# EAGLE design shield_mega_seed4_mpu_lobo8 (EAGLE 9.2.2)
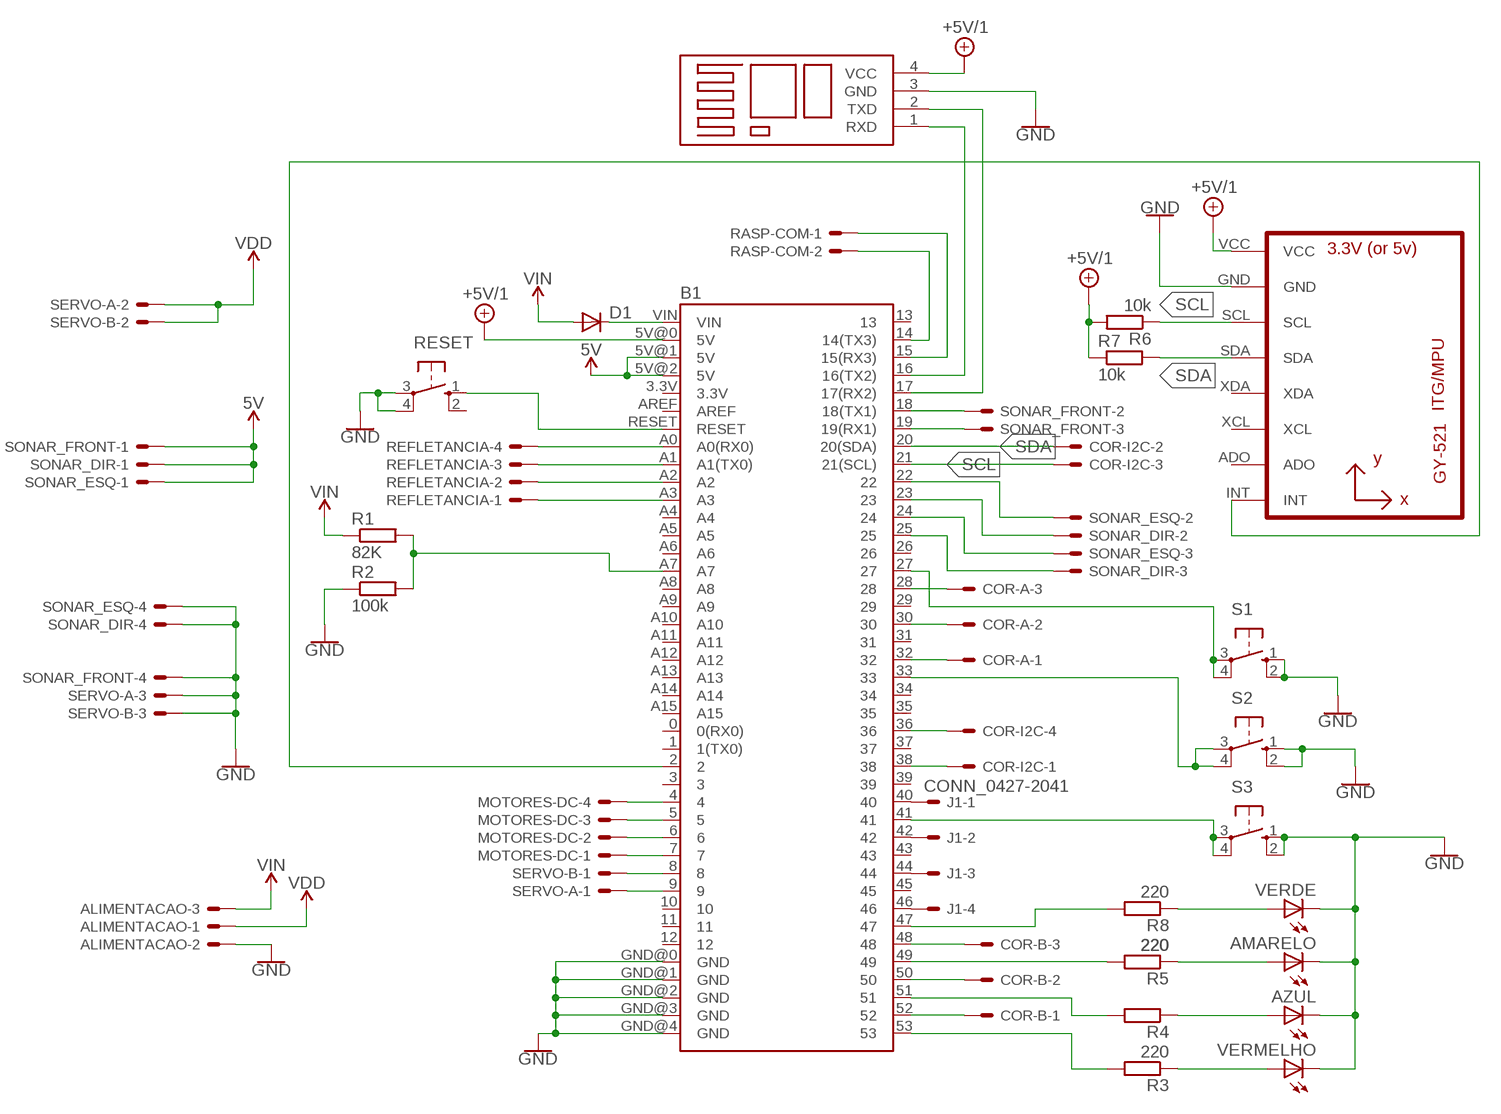
[diagram p0: schematic, sheet 1]

## Parts
ALIMENTACAO  22-23-2031  [22-23-2031]
AMARELO  LED5MM  [LED5MM]
AZUL  LED5MM  [LED5MM]
B1  ARDUINO_MEGA_R3FULL  [ARDUINO_MEGA]
B2  BLUETOOTH  [BLUETOOTH]
COR-A  22-23-2031  [22-23-2031]
COR-B  22-23-2031  [22-23-2031]
COR-I2C  22-23-2041  [22-23-2041]
D1  1N4004  [DO41-10]
J1  CONN_0427-2041  [6410-04]
MOTORES-DC  22-23-2041  [22-23-2041]
R1  82K  R-EU_0204/7  [0204/7]
R2  100k  R-EU_0204/7  [0204/7]
R3  220  R-EU_0207/7  [0207/7]
R4  220  R-EU_0207/7  [0207/7]
R5  220  R-EU_0207/7  [0207/7]
R6  10k  R-EU_0204/7  [0204/7]
R7  10k  R-EU_0204/7  [0204/7]
R8  220  R-EU_0207/7  [0207/7]
RASP-COM  22-23-2021  [22-23-2021]
REFLETANCIA  22-23-2041  [22-23-2041]
RESET  10-XX  [B3F-10XX]
S1  10-XX  [B3F-10XX]
S2  10-XX  [B3F-10XX]
S3  10-XX  [B3F-10XX]
SERVO-A  22-23-2031  [22-23-2031]
SERVO-B  22-23-2031  [22-23-2031]
SONAR_DIR  22-23-2041  [22-23-2041]
SONAR_ESQ  22-23-2041  [22-23-2041]
SONAR_FRONT  22-23-2041  [22-23-2041]
U1  GY-521MPU6050  [GY-521]
VERDE  LED5MM  [LED5MM]
VERMELHO  LED5MM  [LED5MM]

## Nets
5V: B1.5V@1(5V) B1.5V@2(5V) SONAR_DIR.1 SONAR_ESQ.1 SONAR_FRONT.1
+5V/1: B1.5V@0(5V) B2.4(VCC) R6.2 R7.1 U1.VCC
GND: ALIMENTACAO.2 AMARELO.K(C) AZUL.K(C) B1.GND@0(GND) B1.GND@1(GND) B1.GND@2(GND) B1.GND@3(GND) B1.GND@4(GND) B2.3(GND) R2.1 RESET.3(P) RESET.4(P1) S1.1(S) S1.2(S1) S2.1(S) S2.2(S1) S3.1(S) S3.2(S1) SERVO-A.3 SERVO-B.3 SONAR_DIR.4 SONAR_ESQ.4 SONAR_FRONT.4 U1.GND VERDE.K(C) VERMELHO.K(C)
N$1: B1.A2 REFLETANCIA.2
N$2: B1.A3 REFLETANCIA.1
N$3: B1.4 MOTORES-DC.4
N$4: B1.5 MOTORES-DC.3
N$5: B1.6 MOTORES-DC.2
N$6: B1.7 MOTORES-DC.1
N$7: B1.8 SERVO-B.1
N$8: B1.9 SERVO-A.1
N$9: B1.14(14(TX3)) RASP-COM.2
N$10: B1.15(15(RX3)) RASP-COM.1
N$11: B1.19(19(RX1)) SONAR_FRONT.3
N$12: B1.18(18(TX1)) SONAR_FRONT.2
N$13: B1.16(16(TX2)) B2.1(RXD)
N$14: B1.32 COR-A.1
N$15: B1.30 COR-A.2
N$16: B1.38 COR-I2C.1
N$17: B1.52 COR-B.1
N$18: B1.50 COR-B.2
N$19: B1.48 COR-B.3
N$20: B1.A7 R1.2 R2.2
N$21: B1.51 R4.2
N$22: B1.53 R3.2
N$23: B1.49 R5.2
N$24: AMARELO.A R5.1
N$25: AZUL.A R4.1
N$26: R3.1 VERMELHO.A
N$27: B1.33 S2.3(P) S2.4(P1)
N$28: B1.27 S1.3(P) S1.4(P1)
N$29: B1.A1(A1(TX0)) REFLETANCIA.3
N$30: B1.41 S3.3(P) S3.4(P1)
N$31: B1.RESET RESET.1(S)
N$32: B1.VIN D1.C
N$33: B1.A0(A0(RX0)) REFLETANCIA.4
N$34: B1.25 SONAR_DIR.3
N$35: B1.24 SONAR_ESQ.3
N$36: B1.23 SONAR_DIR.2
N$37: B1.22 SONAR_ESQ.2
N$38: B1.47 R8.2
N$39: B1.2 U1.INT
N$40: B1.36 COR-I2C.4
N$41: B1.28 COR-A.3
N$42: R8.1 VERDE.A
N$43: B1.17(17(RX2)) B2.2(TXD)
N$44: B1.40 J1.1
N$45: B1.42 J1.2
N$46: B1.44 J1.3
N$47: B1.46 J1.4
SCL: B1.21(21(SCL)) COR-I2C.3 R6.1 U1.SCL
SDA: B1.20(20(SDA)) COR-I2C.2 R7.2 U1.SDA
VDD: ALIMENTACAO.1 SERVO-A.2 SERVO-B.2
VIN: ALIMENTACAO.3 D1.A R1.1
Unconnected: B1.0(0(RX0)) B1.1(1(TX0)) B1.3 B1.3.3V B1.10 B1.11 B1.12 B1.13 B1.26 B1.29 B1.31 B1.34 B1.35 B1.37 B1.39 B1.43 B1.45 B1.A4 B1.A5 B1.A6 B1.A8 B1.A9 B1.A10 B1.A11 B1.A12 B1.A13 B1.A14 B1.A15 B1.AREF RESET.2(S1) U1.ADO U1.XCL U1.XDA

## Library data of the parts
ALIMENTACAO COR-A COR-B SERVO-A SERVO-B = con-molex:22-23-2031: .100" (2.54mm) Center Header - 3 Pin; MF: MOLEX; MPN: 22-23-2031; OC_FARNELL: 1462950; OC_NEWARK: 30C0862
AMARELO AZUL VERDE VERMELHO = led:LED: LED OSRAM: - CHIPLED LG R971, LG N971, LY N971, LG Q971, LY Q971, LO R971, LY R971 LH N974, LH R974 LS Q976, LO Q976, LY Q976 LO Q996 - Hyper CHIPLED LW Q18S LB Q993, LB Q99A, LB R99A - SideLED LS A670, LO A670, LY A670, LG A670, LP A670 LB A673, LV A673, LT A673, LW A673 LH A674 LY A675 LS A676, LA A676, LO A676, LY A676, LW A676 LS A679, LY A679, LG A679 - Hyper Micro SIDELED® LS Y876, LA Y876, LO Y876, LY Y876 LT Y87S - SmartLED LW L88C, LW L88S LB L89C, LB L89S, LG L890 LS L89K, LO L89K, LY L89K LS L896, LA L896, LO L896, LY L896 - TOPLED LS T670, LO T670, LY T670, LG T670, LP T670 LSG T670, LSP T670, LSY T670, LOP T670, LYG T670 LG T671, LOG T671, LSG T671 LB T673, LV T673, LT T673, LW T673 LH T674 LS T676, LA T676, LO T676, LY T676, LB T676, LH T676, LSB T676, LW T676 LB T67C, LV T67C, LT T67C, LS T67K, LO T67K, LY T67K, LW E67C LS E67B, LA E67B, LO E67B, LY E67B, LB E67C, LV E67C, LT E67C LW T67C LS T679, LY T679, LG T679 LS T770, LO T770, LY T770, LG T770, LP T770 LB T773, LV T773, LT T773, LW T773 LH T774 LS E675, LA E675, LY E675, LS T675 LS T776, LA T776, LO T776, LY T776, LB T776 LHGB T686 LT T68C, LB T68C - Hyper Mini TOPLED® LB M676 - Mini TOPLED Santana® LG M470 LS M47K, LO M47K, LY M47K Source: http://www.osram.convergy.de LUXEON: - LUMILED® LXK2-PW12-R00, LXK2-PW12-S00, LXK2-PW14-U00, LXK2-PW14-V00 LXK2-PM12-R00, LXK2-PM12-S00, LXK2-PM14-U00 LXK2-PE12-Q00, LXK2-PE12-R00, LXK2-PE12-S00, LXK2-PE14-T00, LXK2-PE14-U00 LXK2-PB12-K00, LXK2-PB12-L00, LXK2-PB12-M00, LXK2-PB14-N00, LXK2-PB14-P00, LXK2-PB14-Q00 LXK2-PR12-L00, LXK2-PR12-M00, LXK2-PR14-Q00, LXK2-PR14-R00 LXK2-PD12-Q00, LXK2-PD12-R00, LXK2-PD12-S00 LXK2-PH12-R00, LXK2-PH12-S00 LXK2-PL12-P00, LXK2-PL12-Q00, LXK2-PL12-R00 Source: www.luxeon.com KINGBRIGHT: KA-3528ASYC Source: www.kingbright.com
B1 = SparkFun-Boards3:ARDUINO_MEGA_R3: Arduino Mega R3 ATmega2560 R3 compatible footprint. SparkFun Products: Arduino Mega 2560 R3 <https://www.sparkfun.com/products/11061>
B2 = Bluetooth:BLUETOOTH
COR-I2C MOTORES-DC REFLETANCIA SONAR_DIR SONAR_ESQ SONAR_FRONT = con-molex:22-23-2041: .100" (2.54mm) Center Header - 4 Pin; MF: MOLEX; MPN: 22-23-2041; OC_FARNELL: 1462920; OC_NEWARK: 38C0355
D1 = diode:1N4004: DIODE general purpose rectifier, 1 A
J1 = Robotica-IFRN-SC-conectores:CONN_04: CONNECTOR wire to board 2.54 mm (.1 inch) pitch header; OC_FARNELL: unknown; OC_NEWARK: unknown
R1-R8 = rcl:R-EU_: RESISTOR, European symbol
RASP-COM = con-molex:22-23-2021: .100" (2.54mm) Center Header - 2 Pin; MF: MOLEX; MPN: 22-23-2021; OC_FARNELL: 1462926; OC_NEWARK: 25C3832
RESET S1-S3 = switch-omron:10-XX: OMRON SWITCH; MPN: B3F-1000; OC_FARNELL: 176432; OC_NEWARK: 36M3542
U1 = gy-521:GY-521

## Board
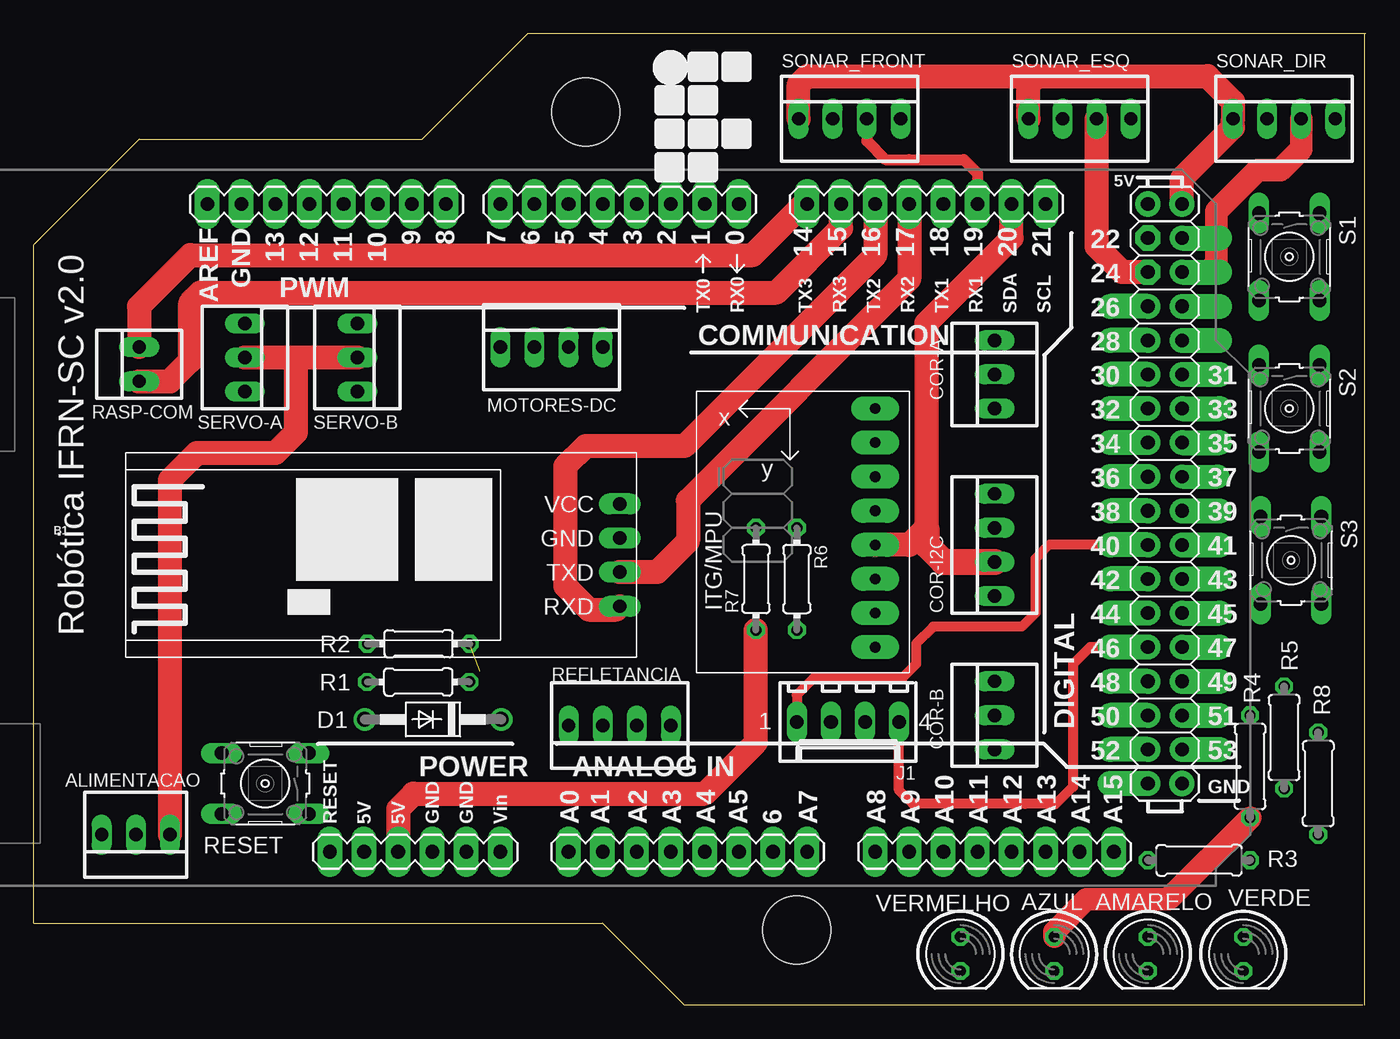
[diagram p1: board, top side]
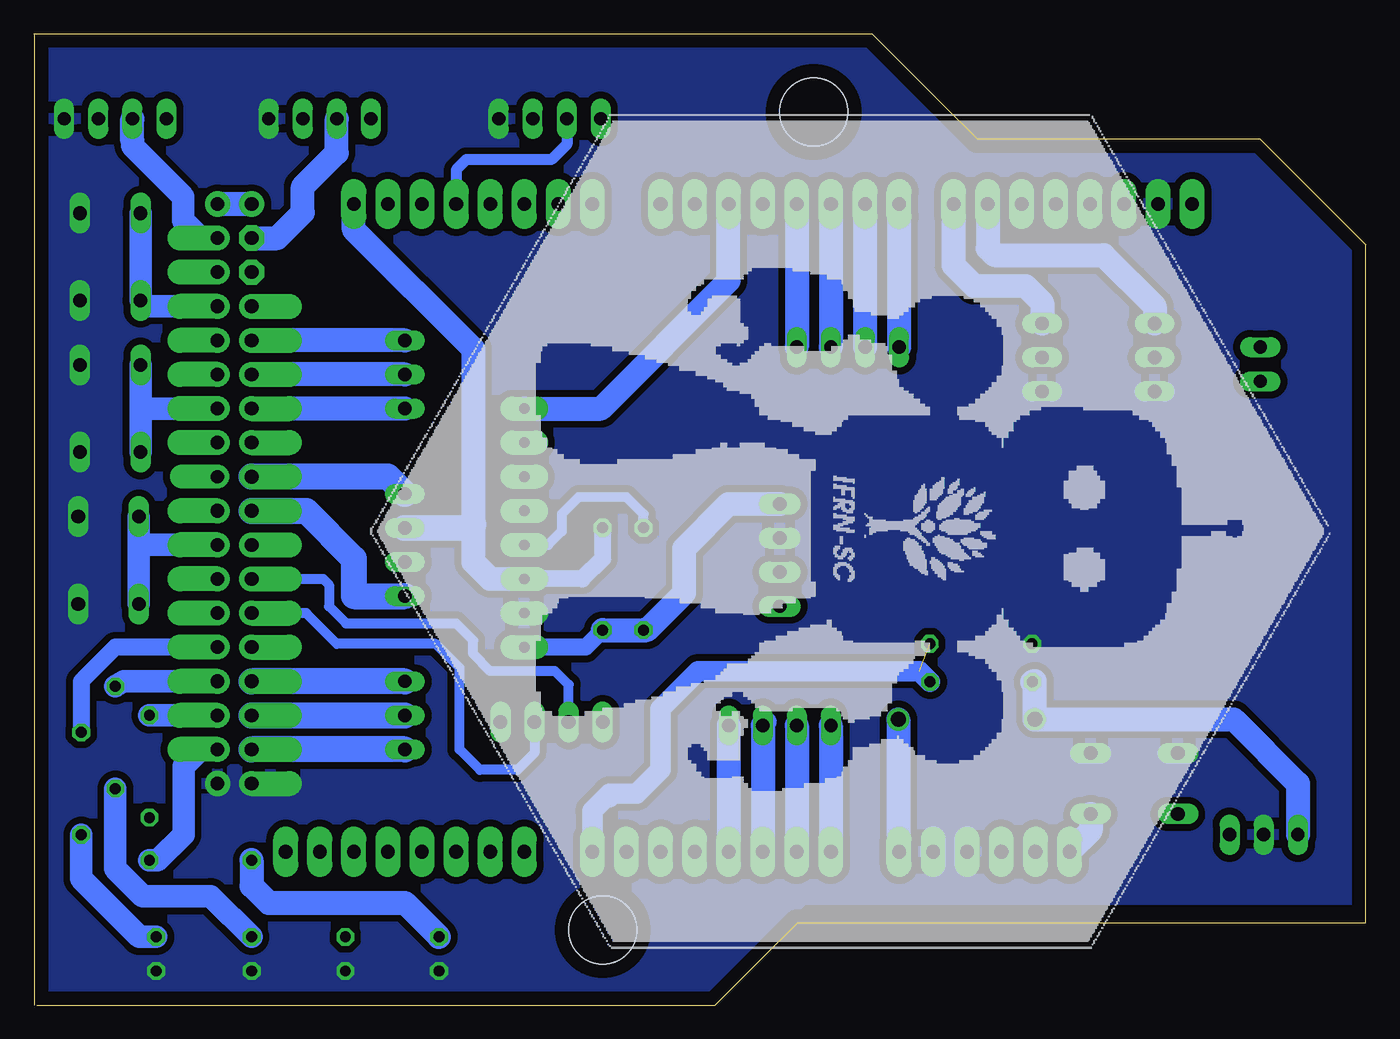
[diagram p2: board, bottom side, seen from below]

Size 99.31 x 72.39 mm. Coordinates in mm from the lower left corner, seen from the top.
Outline: 99.24,0 99.24,72.38
Outline: 99.06,0 48.51,0 42.42,6.1 0,6.1 0,56.64 7.87,64.52 28.96,64.52 36.83,72.39 99.31,72.39
Copper layers (1*16): Top 0.035mm / dielectric 1.5mm / Bottom 0.035mm
Design rules "default *": minimum track width 10mil, minimum drill 24mil, track to track 20mil, track to pad 20mil, pad to pad 20mil, via to via 20mil, smd to smd 8mil, copper to edge 40mil, drill to drill 8mil, minimum pad ring 10mil, minimum via ring 8mil, stop-mask expansion 4mil, vias tented up to drill 0mil, thermal gap 0mil
Holes 5.08 mm at 56.9,5.59 41.15,66.55

### Footprints (pad centres in the part's own frame; a part is rotated, then mirrored left to right if it is on the bottom)
22-23-2031 = drill 1 long: 1 -2.54,0; 2 0,0; 3 2.54,0
LED5MM = drill 0.813 octagon: A -1.27,0; K 1.27,0
ARDUINO_MEGA = drill 1.016 pad 1.88 long: 0 13.97,24.13; 1 11.43,24.13; 2 8.89,24.13; 3 6.35,24.13; 3.3V -13.97,-24.13; 4 3.81,24.13; 5 1.27,24.13; 5V@0 -11.43,-24.13; 6 -1.27,24.13; 7 -3.81,24.13; 8 -7.874,24.13; 9 -10.414,24.13; 10 -12.954,24.13; 11 -15.494,24.13; 12 -18.034,24.13; 13 -20.574,24.13; 14 19.05,24.13; 15 21.59,24.13; 16 24.13,24.13; 17 26.67,24.13; 18 29.21,24.13; 19 31.75,24.13; 20 34.29,24.13; 21 36.83,24.13; A0 1.27,-24.13; A1 3.81,-24.13; A2 6.35,-24.13; A3 8.89,-24.13; A4 11.43,-24.13; A5 13.97,-24.13; A6 16.51,-24.13; A7 19.05,-24.13; A8 24.13,-24.13; A9 26.67,-24.13; A10 29.21,-24.13; A11 31.75,-24.13; A12 34.29,-24.13; A13 36.83,-24.13; A14 39.37,-24.13; A15 41.91,-24.13; AREF -25.654,24.13; GND@0 -8.89,-24.13; GND@1 -6.35,-24.13; GND@4 -23.114,24.13; RESET -16.51,-24.13; VIN -3.81,-24.13 | drill 1.016 pad 1.88: 5V@1 44.45,24.13; 5V@2 46.99,24.13; GND@3 46.99,-19.05 | drill 1.016 pad 1.88 octagon: 22 44.45,21.59; 24 44.45,19.05 | drill 1.016 pad 1.88 offset: 23 46.99,21.59; 25 46.99,19.05; 26 44.45,16.51; 27 46.99,16.51; 28 44.45,13.97; 29 46.99,13.97; 30 44.45,11.43; 31 46.99,11.43; 32 44.45,8.89; 33 46.99,8.89; 34 44.45,6.35; 35 46.99,6.35; 36 44.45,3.81; 38 44.45,1.27; 39 46.99,1.27; 40 44.45,-1.27; 41 46.99,-1.27; 42 44.45,-3.81; 43 46.99,-3.81; 44 44.45,-6.35; 45 46.99,-6.35; 46 44.45,-8.89; 47 46.99,-8.89; 48 44.45,-11.43; 49 46.99,-11.43; 50 44.45,-13.97; 51 46.99,-13.97; 52 44.45,-16.51; 53 46.99,-16.51; GND@2 44.45,-19.05 | drill 1 pad 1.778 offset: 37 46.99,3.81
BLUETOOTH = drill 1 pad 1.549 long: 1 -6.35,3.81; 2 -6.35,1.27; 3 -6.35,-1.27; 4 -6.35,-3.81
22-23-2041 = drill 1 long: 1 -3.81,0; 2 -1.27,0; 3 1.27,0; 4 3.81,0
DO41-10 = drill 1.118: A 5.08,0; C -5.08,0
6410-04 = drill 1.016 long: 1 3.81,0; 2 1.27,0; 3 -1.27,0; 4 -3.81,0
0204/7 = drill 0.813 octagon: 1 -3.81,0; 2 3.81,0
0207/7 = drill 0.813 octagon: 1 -3.81,0; 2 3.81,0
22-23-2021 = drill 1 long: 1 -1.27,0; 2 1.27,0
B3F-10XX = drill 1.016 long: 1 -3.251,2.261; 2 3.251,2.261; 3 -3.251,-2.261; 4 3.251,-2.261
GY-521 = drill 0.8 pad 1.778 long: ADO -8.89,-6.35; GND -8.89,6.35; INT -8.89,-8.89; SCL -8.89,3.81; SDA -8.89,1.27; VCC -8.89,8.89; XCL -8.89,-3.81; XDA -8.89,-1.27

### Placement (x,y rotation side)
ALIMENTACAO  7.62,12.7 180 top
AMARELO  83.06,3.81 270 top
AZUL  76.07,3.81 270 top
B1  38.61,35.56 0 top
B2  37.34,33.53 180 top
COR-A  71.63,46.99 90 top
COR-B  71.63,21.59 90 top
COR-I2C  71.63,34.29 90 top
D1  29.77,21.29 180 top
J1  60.71,21.08 180 top
MOTORES-DC  38.61,49.02 0 top
R1  28.68,24.08 0 top
R2  28.7,26.92 0 top
R3  86.87,10.79 0 top
R4  90.68,17.78 90 top
R5  93.22,19.94 90 top
R6  56.9,31.75 270 top
R7  53.85,31.75 90 top
R8  95.76,16.51 90 top
RASP-COM  7.87,47.75 90 top
REFLETANCIA  43.69,20.83 180 top
RESET  17.27,16.51 180 top
S1  93.6,55.75 270 top
S2  93.6,44.45 270 top
S3  93.73,33.15 270 top
SERVO-A  15.75,48.26 270 top
SERVO-B  24.13,48.26 270 top
SONAR_DIR  93.22,66.04 0 top
SONAR_ESQ  77.98,66.04 0 top
SONAR_FRONT  60.83,66.04 0 top
U1  53.85,35.56 180 top
VERDE  90.17,3.81 270 top
VERMELHO  69.09,3.81 270 top

### Tracks (layer width: path | path; a pad name or v marks a point on that pad's centre or on a via)
5V
  Top 1.778: B1.5V@2 85.6,61.59 89.41,65.41 SONAR_DIR.1 89.41,67.31 87.5,69.22 74.8,69.22 74.49,68.9 | SONAR_ESQ.1 74.17,68.58 74.49,68.9 | 74.49,68.9 74.17,69.22 57.66,69.22 57.02,68.58 SONAR_FRONT.1
  Bottom 1.778: B1.5V@2 B1.5V@1
+5V/1
  Top 1.778: B1.5V@0 27.18,14.61 28.32,15.75 50.04,15.75 53.85,19.56 R7.1
  Bottom 1.27: R6.2 58.17,26.67 U1.VCC
  Bottom 1.778: R6.2 R7.1 53.59,27.94 50.8,30.73 50.8,34.04 47.5,37.34 B2.4
GND
  Bottom 1.778: B1.GND@3 85.65,16.46
  pour Bottom: -0.25,72.39 99.31,72.39 99.31,0.51 99.31,0 49.78,0 41.91,7.87 -0.25,7.87
N$1
  Bottom 1.524: REFLETANCIA.2 44.69,21.1
  Bottom 1.778: REFLETANCIA.2 B1.A2
N$2
  Bottom 1.778: REFLETANCIA.1 B1.A3
N$3
  Bottom 1.778: B1.4 MOTORES-DC.4
N$4
  Bottom 1.778: B1.5 MOTORES-DC.3
N$5
  Bottom 1.778: B1.6 MOTORES-DC.2
N$6
  Bottom 1.778: B1.7 MOTORES-DC.1
N$7
  Bottom 1.778: B1.8 30.73,55.12 29.21,53.59 25.4,53.59 24.13,52.32 SERVO-B.1
N$8
  Bottom 1.778: B1.9 28.19,56.39 27.69,55.88 19.56,55.88 15.75,52.07 SERVO-A.1
N$9
  Top 1.778: B1.14 57.4,59.44 57.15,59.44 53.59,55.88 11.68,55.88 7.87,52.07 RASP-COM.2
N$10
  Top 1.778: B1.15 60.2,57.91 55.37,53.09 12.45,53.09 11.68,52.32 11.68,48.01 10.16,46.48 RASP-COM.1
N$11
  Top 0.813: SONAR_FRONT.3 62.1,64.39 63.5,62.99 65.28,62.99 69.34,62.99 70.36,61.98 B1.19
N$12
  Bottom 0.813: SONAR_FRONT.2 59.56,64.14 60.71,62.99 67.06,62.99 67.82,62.23 B1.18
N$13
  Top 1.778: B1.16 62.74,55.88 48.51,41.66 41.15,41.66 39.62,40.13 39.62,31.24 41.4,29.46 43.43,29.46 B2.1
N$14
  Bottom 1.778: COR-A.1 B1.32
N$15
  Bottom 1.778: COR-A.2 B1.30
N$16
  Bottom 1.93: B1.38 78.99,36.83 75.44,33.27 75.44,30.48 COR-I2C.1
N$17
  Bottom 1.93: COR-B.1 B1.52
N$18
  Bottom 1.93: B1.50 COR-B.2
N$19
  Bottom 1.93: COR-B.3 B1.48
N$20  (1 unrouted)
  Bottom 1.524: R1.2 33.3,24.89 45.21,24.89 48.01,24.89 49.78,24.89 52.58,22.1 52.58,17.53 54.36,15.75 56.39,15.75 | 56.39,15.75 56.39,15.49 | 56.39,15.75 57.66,14.48 B1.A7
N$21
  Bottom 1.676: B1.51 R4.2
N$22
  Bottom 1.676: R3.2 90.04,10.79 88.14,12.7 88.14,17.78 86.87,19.05 B1.53
N$23
  Bottom 1.676: B1.49 92.58,24.13 R5.2
N$24
  Bottom 1.676: R5.1 93.22,10.16 91.19,8.13 86.11,8.13 AMARELO.A
N$25
  Top 1.676: AZUL.A 76.07,5.46 78.49,7.87 84.58,7.87 R4.1
N$26
  Bottom 1.778: R3.1 83.06,8.89 81.79,7.62 71.63,7.62 VERMELHO.A
N$27
  Bottom 1.676: S2.4 91.34,44.7 | 91.34,44.7 S2.3 | B1.33 91.08,44.45 91.34,44.7
N$28
  Bottom 1.676: S1.3 S1.4 90.91,52.07 B1.27
N$29
  Bottom 1.778: REFLETANCIA.3 B1.A1
N$30
  Bottom 1.676: S3.3 91.46,34.29 | 91.46,34.29 S3.4 | B1.41 91.46,34.29
N$31
  Bottom 1.778: RESET.1 20.52,13 B1.RESET
N$32
  Bottom 1.778: D1.C 34.85,11.48 B1.VIN
N$33
  Bottom 1.778: REFLETANCIA.4 B1.A0
N$34
  Top 1.676: B1.25 87.54,54.61 88.17,55.24 88.17,59.14 91.22,62.19 92.92,62.19 94.51,63.77 94.51,66.02 SONAR_DIR.3
N$35
  Top 1.778: B1.24 81.15,54.61 79.25,56.52 SONAR_ESQ.3
N$36
  Bottom 1.676: 86.87,57.15 88.17,58.45 88.17,60.24 91.95,64.02 91.95,64.38
  Bottom 1.778: B1.23 86.87,57.15 | 91.95,64.38 SONAR_DIR.2
N$37
  Bottom 1.778: B1.22 81.15,57.15 79.25,59.05 79.25,60.96 76.71,63.5 SONAR_ESQ.2
N$38
  Bottom 1.27: B1.47 93.22,26.67 95.76,24.13 R8.2
N$39
  Bottom 1.778: U1.INT 57.02,44.45 47.5,53.98 B1.2
N$40
  Bottom 1.93: COR-I2C.4 72.9,39.37 75.69,39.37 B1.36
N$41
  Bottom 1.778: COR-A.3 B1.28
N$42
  Bottom 1.676: R8.1 95.76,9.4 91.44,5.08 VERDE.A
N$43
  Top 1.778: B1.17 65.28,54.1 48.77,37.59 48.77,34.54 46.48,32.26 B2.2
N$44
  Top 0.762: B1.40 75.69,34.29 74.68,33.27 74.68,29.21 73.66,28.19 67.06,28.19 65.79,26.92 65.79,25.4 64.77,24.38 58.17,24.38 56.9,23.11 J1.1
N$45
  Bottom 0.762: J1.2 59.44,23.88 60.45,24.89 65.28,24.89 66.55,26.16 66.55,27.18 67.82,28.45 76.03,28.45 77.29,29.71 77.29,31.32 77.72,31.75 B1.42
N$46
  Bottom 0.762: J1.3 61.98,18.8 63.25,17.53 66.04,17.53 67.56,19.05 67.56,25.15 69.34,26.92 76.71,26.92 78.99,29.21 B1.44
N$47
  Top 0.762: B1.46 78.74,26.67 77.47,25.4 77.47,16.26 76.2,14.99 73.91,14.99 | 73.91,14.99 65.53,14.99 64.52,16 J1.4 | 73.91,14.99
SCL
  Bottom 1.27: R6.1 56.9,33.27 58.42,31.75 U1.SCL
  Bottom 1.778: U1.SCL 65.28,31.75 66.55,33.02 66.55,35.81 66.55,48.89 75.44,57.78 B1.21
  Bottom 1.93: COR-I2C.3 66.8,35.56 66.55,35.81
SDA
  Top 1.778: U1.SDA 65.28,34.29 66.55,35.56 66.55,50.8 72.9,57.15 B1.20
  Top 1.93: 66.55,35.56 66.55,34.29 67.82,33.02 COR-I2C.2
  Bottom 0.762: R7.2 53.85,36.58 55.12,37.85 58.67,37.85 59.94,36.58 59.94,35.31 60.96,34.29 U1.SDA
VDD
  Top 1.778: ALIMENTACAO.1 10.16,39.12 12.19,41.15 18.03,41.15 19.56,42.67 19.56,48.26 | SERVO-A.2 19.56,48.26 | 19.56,48.26 SERVO-B.2
VIN
  Bottom 1.778: ALIMENTACAO.3 5.08,16.51 9.86,21.29 D1.A 24.69,24.16 R1.1

### Text on the board
tPlace: Robótica IFRN-SC v2.0